# Altium schematic sheet etapa_1_2.SchDoc
size A4
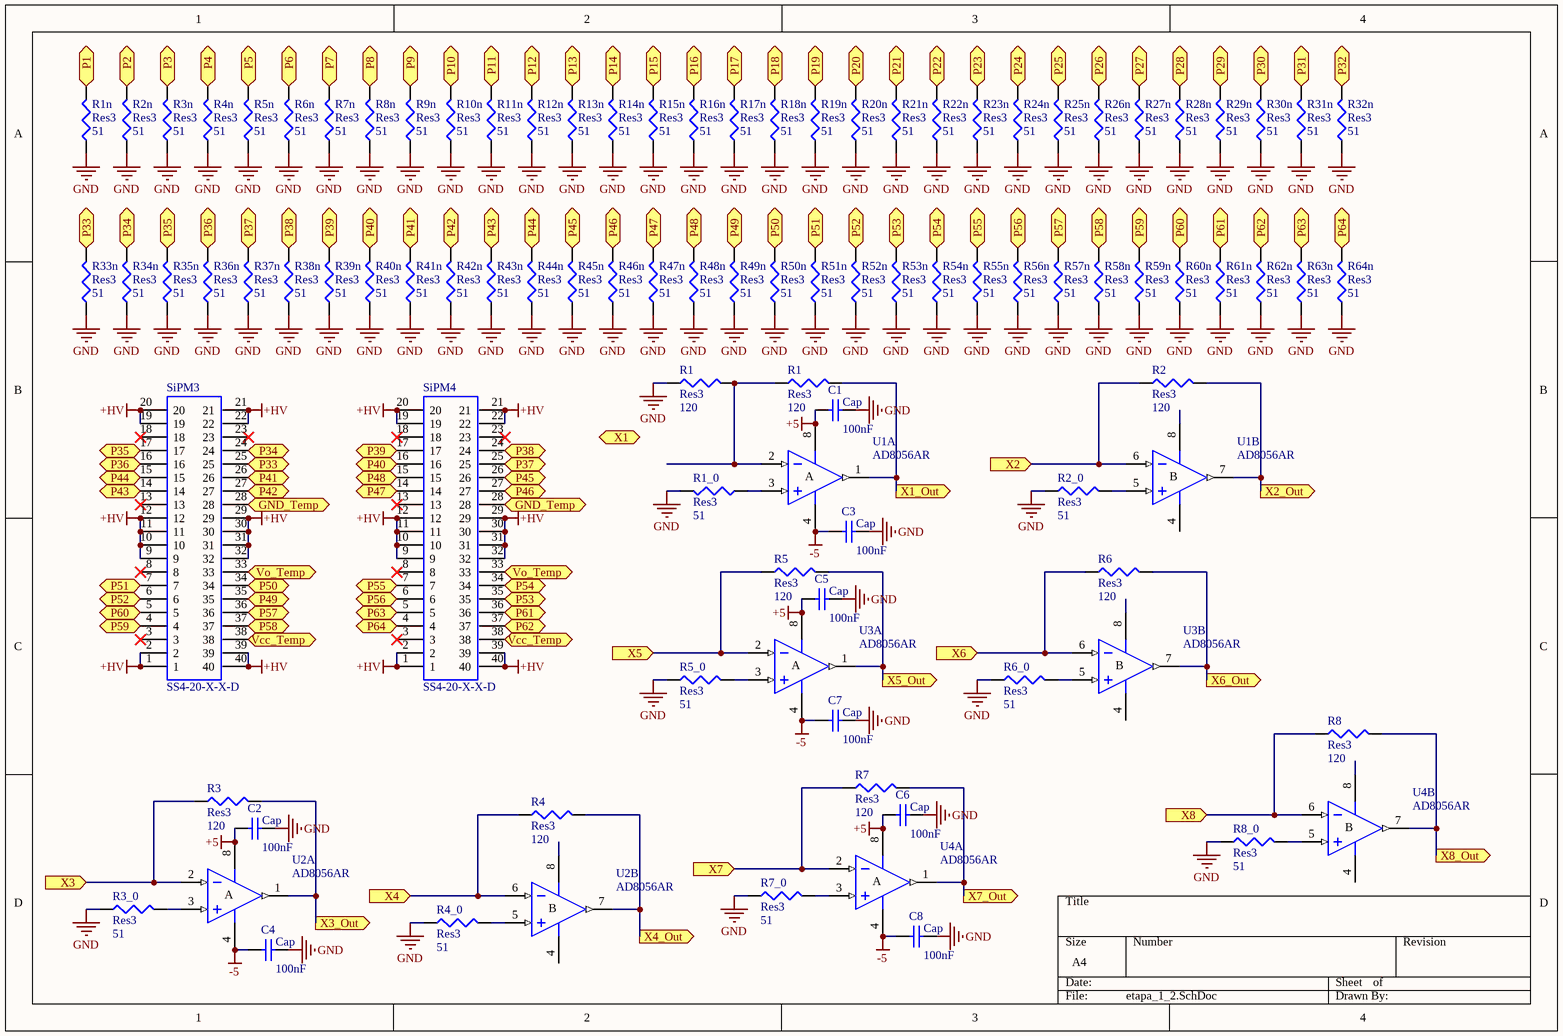
[diagram p0: etapa_1_2.SchDoc]

## Parts
(Parts that share a designator on the sheet are numbered #1, #2 ... from top to bottom, then left to right.)
C1  Cap  value 100nF  [1608[0603]]
C2  Cap  value 100nF  [1608[0603]]
C3  Cap  value 100nF  [1608[0603]]
C4  Cap  value 100nF  [1608[0603]]
C5  Cap  value 100nF  [1608[0603]]
C6  Cap  value 100nF  [1608[0603]]
C7  Cap  value 100nF  [1608[0603]]
C8  Cap  value 100nF  [1608[0603]]
R1#1  Res3  value 120  [0402]
R1#2  Res3  value 120  [0402]
R1_0  Res3  value 51  [0402]
R1n  Res3  value 51  [0402]
R2  Res3  value 120  [0402]
R2_0  Res3  value 51  [0402]
R2n  Res3  value 51  [0402]
R3  Res3  value 120  [0402]
R3_0  Res3  value 51  [0402]
R3n  Res3  value 51  [0402]
R4  Res3  value 120  [0402]
R4_0  Res3  value 51  [0402]
R4n  Res3  value 51  [0402]
R5  Res3  value 120  [0402]
R5_0  Res3  value 51  [0402]
R5n  Res3  value 51  [0402]
R6  Res3  value 120  [0402]
R6_0  Res3  value 51  [0402]
R6n  Res3  value 51  [0402]
R7  Res3  value 120  [0402]
R7_0  Res3  value 51  [0402]
R7n  Res3  value 51  [0402]
R8  Res3  value 120  [0402]
R8_0  Res3  value 51  [0402]
R8n  Res3  value 51  [0402]
R9n  Res3  value 51  [0402]
R10n  Res3  value 51  [0402]
R11n  Res3  value 51  [0402]
R12n  Res3  value 51  [0402]
R13n  Res3  value 51  [0402]
R14n  Res3  value 51  [0402]
R15n  Res3  value 51  [0402]
R16n  Res3  value 51  [0402]
R17n  Res3  value 51  [0402]
R18n  Res3  value 51  [0402]
R19n  Res3  value 51  [0402]
R20n  Res3  value 51  [0402]
R21n  Res3  value 51  [0402]
R22n  Res3  value 51  [0402]
R23n  Res3  value 51  [0402]
R24n  Res3  value 51  [0402]
R25n  Res3  value 51  [0402]
R26n  Res3  value 51  [0402]
R27n  Res3  value 51  [0402]
R28n  Res3  value 51  [0402]
R29n  Res3  value 51  [0402]
R30n  Res3  value 51  [0402]
R31n  Res3  value 51  [0402]
R32n  Res3  value 51  [0402]
R33n  Res3  value 51  [0402]
R34n  Res3  value 51  [0402]
R35n  Res3  value 51  [0402]
R36n  Res3  value 51  [0402]
R37n  Res3  value 51  [0402]
R38n  Res3  value 51  [0402]
R39n  Res3  value 51  [0402]
R40n  Res3  value 51  [0402]
R41n  Res3  value 51  [0402]
R42n  Res3  value 51  [0402]
R43n  Res3  value 51  [0402]
R44n  Res3  value 51  [0402]
R45n  Res3  value 51  [0402]
R46n  Res3  value 51  [0402]
R47n  Res3  value 51  [0402]
R48n  Res3  value 51  [0402]
R49n  Res3  value 51  [0402]
R50n  Res3  value 51  [0402]
R51n  Res3  value 51  [0402]
R52n  Res3  value 51  [0402]
R53n  Res3  value 51  [0402]
R54n  Res3  value 51  [0402]
R55n  Res3  value 51  [0402]
R56n  Res3  value 51  [0402]
R57n  Res3  value 51  [0402]
R58n  Res3  value 51  [0402]
R59n  Res3  value 51  [0402]
R60n  Res3  value 51  [0402]
R61n  Res3  value 51  [0402]
R62n  Res3  value 51  [0402]
R63n  Res3  value 51  [0402]
R64n  Res3  value 51  [0402]
SiPM3  SS4-20-X-X-D  [SS4-20-X-X-D]
SiPM4  SS4-20-X-X-D  [SS4-20-X-X-D]
U1  AD8056AR  [RM-8]  (parts A,B of 2)
U2  AD8056AR  [RM-8]  (parts A,B of 2)
U3  AD8056AR  [RM-8]  (parts A,B of 2)
U4  AD8056AR  [RM-8]  (parts A,B of 2)

## Ports
GND_Temp (out), P1 (in), P2 (in), P3 (in), P4 (in), P5 (in), P6 (in), P7 (in), P8 (in), P9 (in), P10 (in), P11 (in), P12 (in), P13 (in), P14 (in), P15 (in), P16 (in), P17 (in), P18 (in), P19 (in), P20 (in), P21 (in), P22 (in), P23 (in), P24 (in), P25 (in), P26 (in), P27 (in), P28 (in), P29 (in), P30 (in), P31 (in), P32 (in), P33 (in), P33 (out), P34 (in), P34 (out), P35 (in), P35 (out), P36 (in), P36 (out), P37 (in), P37 (out), P38 (in), P38 (out), P39 (in), P39 (out), P40 (in), P40 (out), P41 (in), P41 (out), P42 (in), P42 (out), P43 (in), P43 (out), P44 (in), P44 (out), P45 (in), P45 (out), P46 (in), P46 (out), P47 (in), P47 (out), P48 (in), P48 (out), P49 (in), P49 (out), P50 (in), P50 (out), P51 (in), P51 (out), P52 (in), P52 (out), P53 (in), P53 (out), P54 (in), P54 (out), P55 (in), P55 (out), P56 (in), P56 (out), P57 (in), P57 (out), P58 (in), P58 (out), P59 (in), P59 (out), P60 (in), P60 (out), P61 (in), P61 (out), P62 (in), P62 (out), P63 (in), P63 (out), P64 (in), P64 (out), Vcc_Temp (out), Vo_Temp (out), X1 (in), X1_Out (out), X2 (in), X2_Out (out), X3 (in), X3_Out (out), X4 (in), X4_Out (out), X5 (in), X5_Out (out), X6 (in), X6_Out (out), X7 (in), X7_Out (out), X8 (in), X8_Out (out)

## Nets
+5: C1.2 C2.2 C5.2 C6.2 U1.8(V+) U2.8(V+) U3.8(V+) U4.8(V+)
+HV: SiPM3.1 SiPM3.2 SiPM3.9 SiPM3.10 SiPM3.11 SiPM3.12 SiPM3.19 SiPM3.20 SiPM3.21 SiPM3.22 SiPM3.29 SiPM3.30 SiPM3.31 SiPM3.32 SiPM3.39 SiPM3.40 SiPM4.1 SiPM4.2 SiPM4.9 SiPM4.10 SiPM4.11 SiPM4.12 SiPM4.19 SiPM4.20 SiPM4.21 SiPM4.22 SiPM4.29 SiPM4.30 SiPM4.31 SiPM4.32 SiPM4.39 SiPM4.40
-5: C3.2 C4.2 C7.2 C8.2 U1.4(V-) U2.4(V-) U3.4(V-) U4.4(V-)
GND: C1.1 C2.1 C3.1 C4.1 C5.1 C6.1 C7.1 C8.1 R1#1.1 R1_0.2 R1n.1 R2_0.1 R2n.1 R3_0.1 R3n.1 R4_0.1 R4n.1 R5_0.1 R5n.1 R6_0.1 R6n.1 R7_0.1 R7n.1 R8_0.1 R8n.1 R9n.1 R10n.1 R11n.1 R12n.1 R13n.1 R14n.1 R15n.1 R16n.1 R17n.1 R18n.1 R19n.1 R20n.1 R21n.1 R22n.1 R23n.1 R24n.1 R25n.1 R26n.1 R27n.1 R28n.1 R29n.1 R30n.1 R31n.1 R32n.1 R33n.1 R34n.1 R35n.1 R36n.1 R37n.1 R38n.1 R39n.1 R40n.1 R41n.1 R42n.1 R43n.1 R44n.1 R45n.1 R46n.1 R47n.1 R48n.1 R49n.1 R50n.1 R51n.1 R52n.1 R53n.1 R54n.1 R55n.1 R56n.1 R57n.1 R58n.1 R59n.1 R60n.1 R61n.1 R62n.1 R63n.1 R64n.1
GND_Temp: SiPM3.28 SiPM4.28 ; port GND_Temp
P1: R1n.2 ; port P1
P2: R2n.2 ; port P2
P3: R3n.2 ; port P3
P4: R4n.2 ; port P4
P5: R5n.2 ; port P5
P6: R6n.2 ; port P6
P7: R7n.2 ; port P7
P8: R8n.2 ; port P8
P9: R9n.2 ; port P9
P10: R10n.2 ; port P10
P11: R11n.2 ; port P11
P12: R12n.2 ; port P12
P13: R13n.2 ; port P13
P14: R14n.2 ; port P14
P15: R15n.2 ; port P15
P16: R16n.2 ; port P16
P17: R17n.2 ; port P17
P18: R18n.2 ; port P18
P19: R19n.2 ; port P19
P20: R20n.2 ; port P20
P21: R21n.2 ; port P21
P22: R22n.2 ; port P22
P23: R23n.2 ; port P23
P24: R24n.2 ; port P24
P25: R25n.2 ; port P25
P26: R26n.2 ; port P26
P27: R27n.2 ; port P27
P28: R28n.2 ; port P28
P29: R29n.2 ; port P29
P30: R30n.2 ; port P30
P31: R31n.2 ; port P31
P32: R32n.2 ; port P32
P33: R33n.2 SiPM3.25 ; port P33
P34: R34n.2 SiPM3.24 ; port P34
P35: R35n.2 SiPM3.17 ; port P35
P36: R36n.2 SiPM3.16 ; port P36
P37: R37n.2 SiPM4.25 ; port P37
P38: R38n.2 SiPM4.24 ; port P38
P39: R39n.2 SiPM4.17 ; port P39
P40: R40n.2 SiPM4.16 ; port P40
P41: R41n.2 SiPM3.26 ; port P41
P42: R42n.2 SiPM3.27 ; port P42
P43: R43n.2 SiPM3.14 ; port P43
P44: R44n.2 SiPM3.15 ; port P44
P45: R45n.2 SiPM4.26 ; port P45
P46: R46n.2 SiPM4.27 ; port P46
P47: R47n.2 SiPM4.14 ; port P47
P48: R48n.2 SiPM4.15 ; port P48
P49: R49n.2 SiPM3.35 ; port P49
P50: R50n.2 SiPM3.34 ; port P50
P51: R51n.2 SiPM3.7 ; port P51
P52: R52n.2 SiPM3.6 ; port P52
P53: R53n.2 SiPM4.35 ; port P53
P54: R54n.2 SiPM4.34 ; port P54
P55: R55n.2 SiPM4.7 ; port P55
P56: R56n.2 SiPM4.6 ; port P56
P57: R57n.2 SiPM3.36 ; port P57
P58: R58n.2 SiPM3.37 ; port P58
P59: R59n.2 SiPM3.4 ; port P59
P60: R60n.2 SiPM3.5 ; port P60
P61: R61n.2 SiPM4.36 ; port P61
P62: R62n.2 SiPM4.37 ; port P62
P63: R63n.2 SiPM4.5 ; port P63
P64: R64n.2 SiPM4.4 ; port P64
Vcc_Temp: SiPM3.38 SiPM4.38 ; port Vcc_Temp
Vo_Temp: SiPM3.33 SiPM4.33 ; port Vo_Temp
X1_Out: R1#2.2 U1.1(OUT) ; port X1_Out
X2: R2.1 U1.6(IN-) ; port X2
X2_Out: R2.2 U1.7(OUT) ; port X2_Out
X3: R3.1 U2.2(IN-) ; port X3
X3_Out: R3.2 U2.1(OUT) ; port X3_Out
X4: R4.1 U2.6(IN-) ; port X4
X4_Out: R4.2 U2.7(OUT) ; port X4_Out
X5: R5.1 U3.2(IN-) ; port X5
X5_Out: R5.2 U3.1(OUT) ; port X5_Out
X6: R6.1 U3.6(IN-) ; port X6
X6_Out: R6.2 U3.7(OUT) ; port X6_Out
X7: R7.1 U4.2(IN-) ; port X7
X7_Out: R7.2 U4.1(OUT) ; port X7_Out
X8: R8.1 U4.6(IN-) ; port X8
X8_Out: R8.2 U4.7(OUT) ; port X8_Out
NetR1#1_2: R1#1.2 R1#2.1 U1.2(IN-)
NetR1_0_1: R1_0.1 U1.3(IN+)
NetR2_0_2: R2_0.2 U1.5(IN+)
NetR3_0_2: R3_0.2 U2.3(IN+)
NetR4_0_2: R4_0.2 U2.5(IN+)
NetR5_0_2: R5_0.2 U3.3(IN+)
NetR6_0_2: R6_0.2 U3.5(IN+)
NetR7_0_2: R7_0.2 U4.3(IN+)
NetR8_0_2: R8_0.2 U4.5(IN+)

Not connected (* = marked no-connect by the designer): SiPM3 3* 8* 13* 18* 23*; SiPM4 3* 8* 13* 18* 23*

## Notes on the sheet
- (in symbol AD8056AR, part A) A
- (in symbol AD8056AR, part B) B

## Library data of the parts
C1-C8 = Cap: Capacitor; Published: 8-Jun-2000; LatestRevisionDate: 17-Jul-2002; LatestRevisionNote: Re-released for DXP Platform.; PackageReference: RAD-0.3; Publisher: Altium Limited; PackageDescription: Radial Cap, Thru-Hole; 2 Leads; 0.3 in Pin Spacing
R1#1 R1#2 R1_0 R1n R2 R2_0 R2n R3 R3_0 R3n R4 R4_0 R4n R5 R5_0 R5n R6 R6_0 R6n R7 R7_0 R7n R8 R8_0 R8n R9n R10n R11n R12n R13n R14n R15n R16n R17n R18n R19n R20n R21n R22n R23n R24n R25n R26n R27n R28n R29n R30n R31n R32n R33n R34n R35n R36n R37n R38n R39n R40n R41n R42n R43n R44n R45n R46n R47n R48n R49n R50n R51n R52n R53n R54n R55n R56n R57n R58n R59n R60n R61n R62n R63n R64n = Res3: Resistor; Published: 8-Jun-2000; LatestRevisionDate: 29-May-2009; LatestRevisionNote: IPC-7351 Footprint Added.; PackageReference: J1-0603; Publisher: Altium Limited; PackageDescription: Chip Resistor
U1-U4 = AD8056AR: Low Cost, 300MHz Voltage Feedback Amplifier; Published: 8-Jun-2000; LatestRevisionDate: 13-Apr-2006; LatestRevisionNote: IPC-7351 Footprint Added.; DatasheetVersion: REV. 0 1997; PackageVersion: revA; PackageReference: SO-8; Publisher: Altium Limited; PackageDescription: 8-Pin Small Outline Integrated Circuit 1.27 mm Pitch; Code_JEDEC: MS-012-AA; Code_IPC: SOIC127P600-8; ComponentLink1Description: Manufacturer Link; ComponentLink1URL: http://www.analog.com/en/prod/0,,759_786_AD8055%2C00.html; ComponentLink2Description: Datasheet; ComponentLink2URL: http://www.analog.com/UploadedFiles/Data_Sheets/40402558757264AD8055_6_i.pdf